# EAGLE schematic ALINHAMENTO_UNIC (EAGLE 6.2)
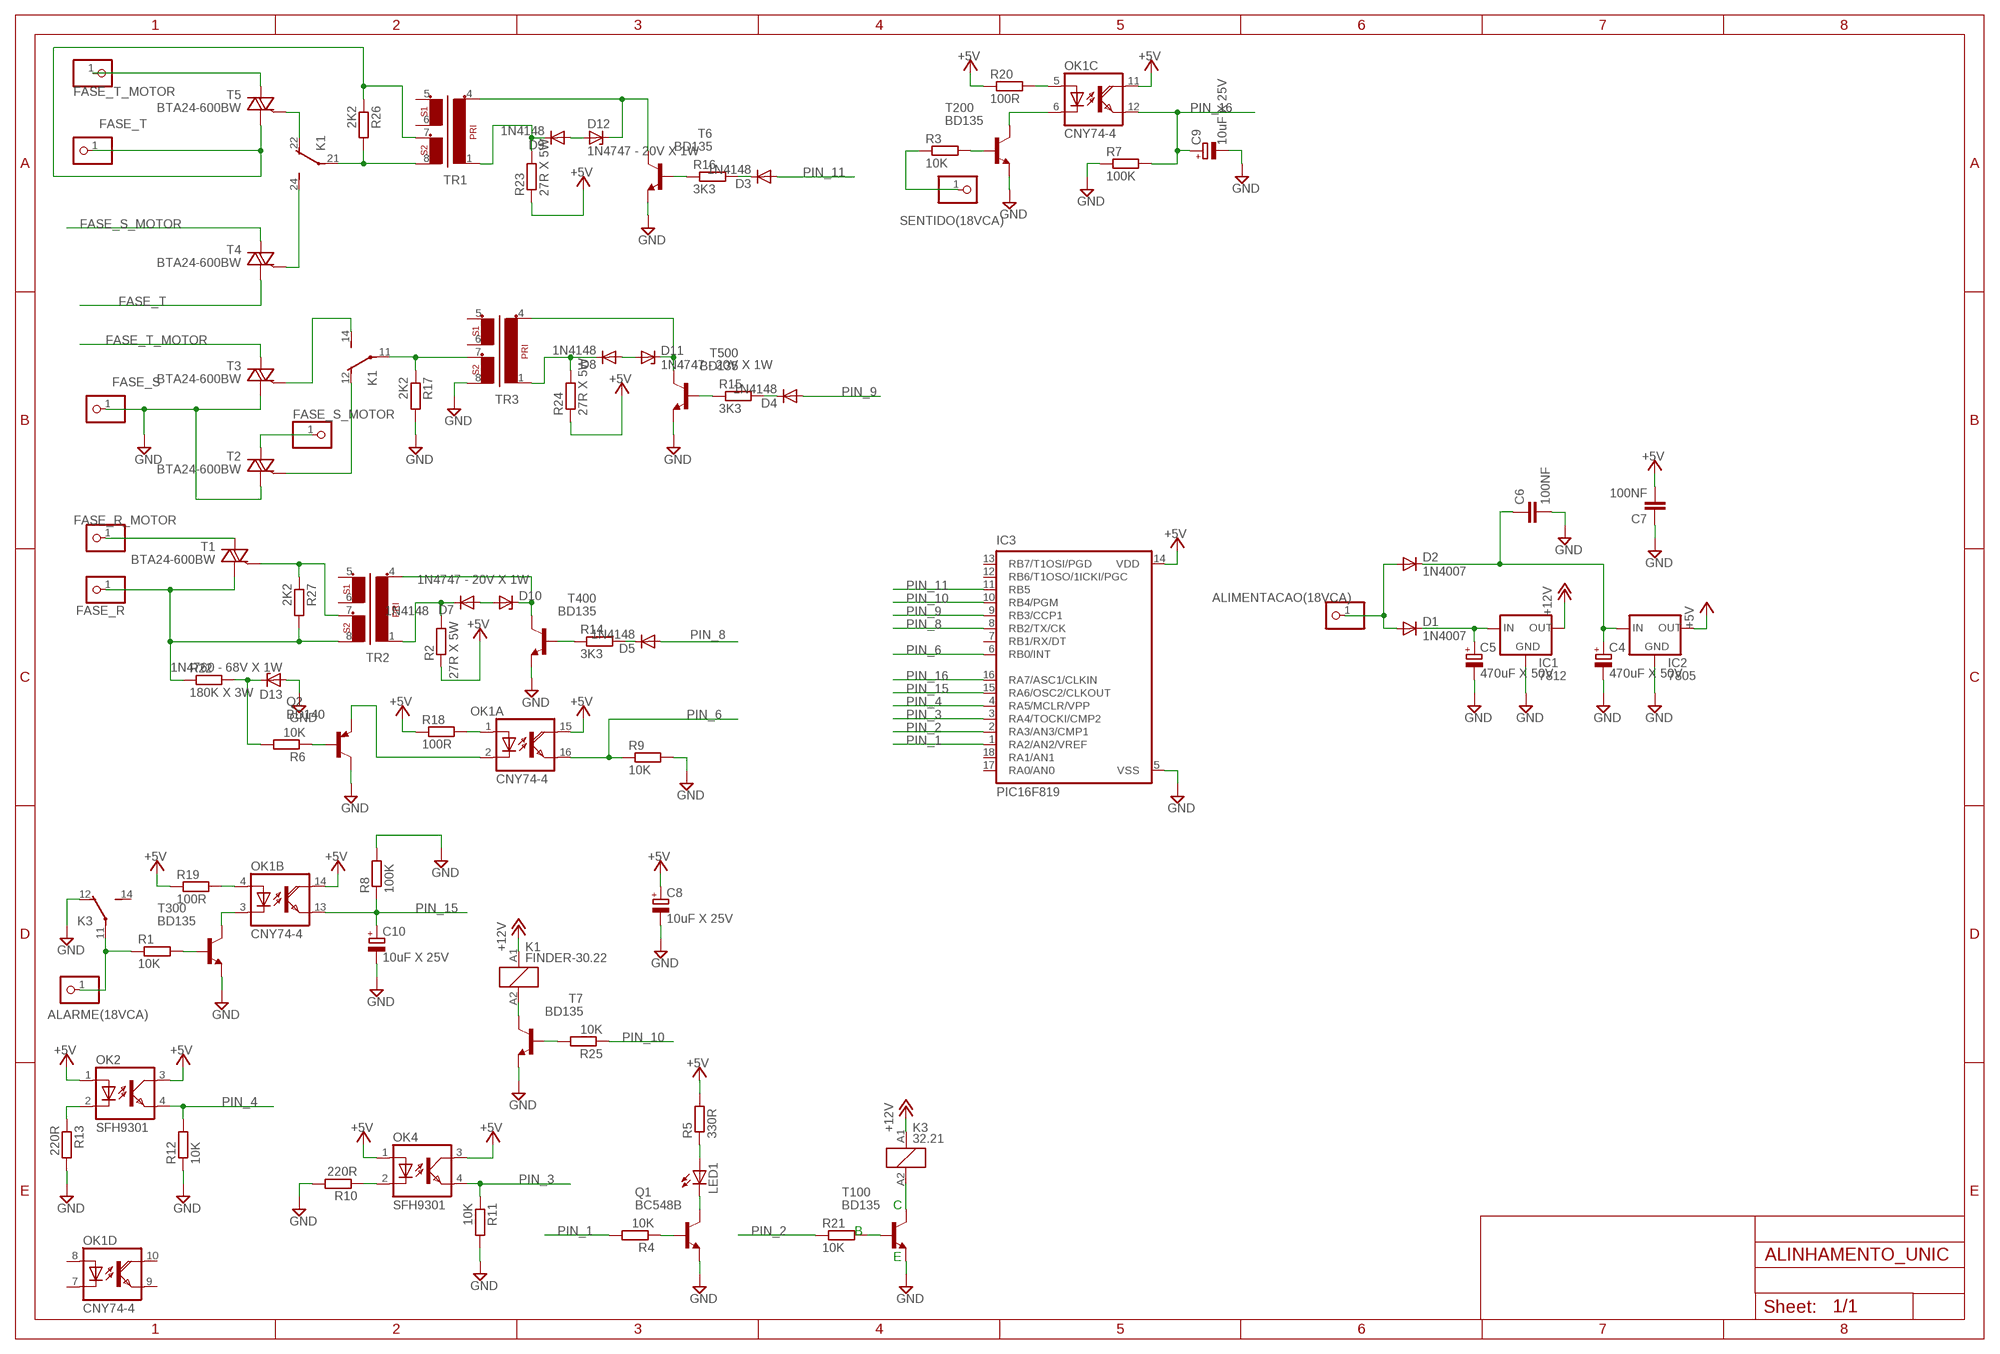
[diagram p0: schematic, sheet 1]

## Parts
ALARME(18VCA)  PINHD-1X1  [1X01]
ALIMENTACAO(18VCA)  PINHD-1X1  [1X01]
C4  470uF X 50V  CPOL-EUE5-13  [E5-13]
C5  470uF X 50V  CPOL-EUE5-13  [E5-13]
C6  100NF  C-EU050-025X075  [C050-025X075]
C7  100NF  C-EU050-025X075  [C050-025X075]
C8  10uF X 25V  CPOL-EUE2-5  [E2-5]
C9  10uF X 25V  CPOL-EUE2-5  [E2-5]
C10  10uF X 25V  CPOL-EUE2-5  [E2-5]
D1  1N4007  1N4004  [DO41-10]
D2  1N4007  1N4004  [DO41-10]
D3  1N4148  1N4148DO35-10  [DO35-10]
D4  1N4148  1N4148DO35-10  [DO35-10]
D5  1N4148  1N4148DO35-10  [DO35-10]
D7  1N4148  1N4148DO35-10  [DO35-10]
D8  1N4148  1N4148DO35-10  [DO35-10]
D9  1N4148  1N4148DO35-10  [DO35-10]
D10  1N4747 - 20V X 1W  1N4728  [DO41Z10]
D11  1N4747 - 20V X 1W  1N4728  [DO41Z10]
D12  1N4747 - 20V X 1W  1N4728  [DO41Z10]
D13  1N4760 - 68V X 1W  1N4728  [DO41Z10]
FASE_R  PINHD-1X1  [1X01]
FASE_R_MOTOR  PINHD-1X1  [1X01]
FASE_S  PINHD-1X1  [1X01]
FASE_S_MOTOR  PINHD-1X1  [1X01]
FASE_T  PINHD-1X1  [1X01]
FASE_T_MOTOR  PINHD-1X1  [1X01]
IC1  7812  78MXXS  [78MXXS]
IC2  7805  78MXXS  [78MXXS]
IC3  PIC16F819  PIC16F627P  [DIL18]
K1  FINDER-30.22  [FINDER-30.22]
K3  32.21  [RP51]
LED1  LED5MM  [LED5MM]
OK1  CNY74-4  ILQ30  [DIL16]
OK2  SFH9301  [SFH9301]
OK4  SFH9301  [SFH9301]
Q1  BC548B  [TO92-EBC]
Q2  BD140  [TO126]
R1  10K  R-EU_0207/10  [0207/10]
R2  27R X 5W  R-EU_0617/22  [0617/22]
R3  10K  R-EU_0207/10  [0207/10]
R4  10K  R-EU_0207/10  [0207/10]
R5  330R  R-EU_0207/10  [0207/10]
R6  10K  R-EU_0207/10  [0207/10]
R7  100K  R-EU_0207/10  [0207/10]
R8  100K  R-EU_0207/10  [0207/10]
R9  10K  R-EU_0207/10  [0207/10]
R10  220R  R-EU_0207/10  [0207/10]
R11  10K  R-EU_0207/10  [0207/10]
R12  10K  R-EU_0207/10  [0207/10]
R13  220R  R-EU_0207/10  [0207/10]
R14  3K3  R-EU_0207/10  [0207/10]
R15  3K3  R-EU_0207/10  [0207/10]
R16  3K3  R-EU_0207/10  [0207/10]
R17  2K2  R-EU_0207/10  [0207/10]
R18  100R  R-EU_0207/10  [0207/10]
R19  100R  R-EU_0207/10  [0207/10]
R20  100R  R-EU_0207/10  [0207/10]
R21  10K  R-EU_0207/10  [0207/10]
R22  180K X 3W  R-EU_0617/22  [0617/22]
R23  27R X 5W  R-EU_0617/22  [0617/22]
R24  27R X 5W  R-EU_0617/22  [0617/22]
R25  10K  R-EU_0207/10  [0207/10]
R26  2K2  R-EU_0207/10  [0207/10]
R27  2K2  R-EU_0207/10  [0207/10]
SENTIDO(18VCA)  PINHD-1X1  [1X01]
T1  BTA24-600BW  BTA26-V  [TOP3S-1]
T2  BTA24-600BW  BTA26-V  [TOP3S-1]
T3  BTA24-600BW  BTA26-V  [TOP3S-1]
T4  BTA24-600BW  BTA26-V  [TOP3S-1]
T5  BTA24-600BW  BTA26-V  [TOP3S-1]
T6  BD135  BD139  [TO126]
T7  BD135  BD139  [TO126]
T100  BD135  BD139  [TO126]
T200  BD135  BD139  [TO126]
T300  BD135  BD139  [TO126]
T400  BD135  BD139  [TO126]
T500  BD135  BD139  [TO126]
TR1  EE20-2  [EE20-2]
TR2  EE20-2  [EE20-2]
TR3  EE20-2  [EE20-2]

## Nets
+5V: C7.2 C8.+ IC2.OUT IC3.14(VDD) OK1.11(C:COL) OK1.14(B:COL) OK1.15(A:COL) OK2.1(A) OK2.3(COL) OK4.1(A) OK4.3(COL) R2.1 R5.2 R18.1 R19.1 R20.1 R23.1 R24.1
+12V: IC1.OUT K1.A1 K3.A1
FASE_S_MOTOR: FASE_S_MOTOR.1 T2.A2 T4.A2
FASE_T: FASE_T.1 R26.1 T4.A1 T5.A1 TR1.7
FASE_T_MOTOR: FASE_T_MOTOR.1 T3.A2 T5.A2
GND: C4.- C5.- C6.2 C7.1 C8.- C9.- C10.- D13.A FASE_S.1 IC1.GND IC2.GND IC3.5(VSS) K3.12(O) Q1.E Q2.2(C) R7.1 R8.2 R9.2 R10.2 R11.2 R12.1 R13.2 R17.2 T2.A1 T3.A1 T6.1(E) T7.1(E) T100.1(E) T200.1(E) T300.1(E) T400.1(E) T500.1(E) TR3.8
N$1: OK4.2(C) R10.1
N$2: OK2.2(C) R13.1
N$3: ALIMENTACAO(18VCA).1 D1.A D2.A
N$5: C5.+ D1.C IC1.IN
N$6: R27.1 T1.G TR2.7
N$7: C4.+ C6.1 D2.C IC2.IN
N$9: Q1.B R4.1
N$10: K3.A2 T100.2(C)
N$11: R25.2 T7.3(B)
N$12: LED1.A R5.1
N$13: OK1.1(A:A) R18.2
N$14: K1.A2 T7.2(C)
N$15: D5.C R14.2
N$16: D9.A D12.A
N$17: FASE_R_MOTOR.1 T1.A2
N$18: D4.C R15.2
N$19: D3.C R16.2
N$20: OK1.2(A:C) Q2.1(E)
N$21: Q2.3(B) R6.1
N$22: FASE_R.1 R22.1 R27.2 T1.A1 TR2.8
N$24: D8.A D11.A
N$25: D7.A D10.A
N$26: K1.21(-2:P) R26.2 TR1.8
N$27: K1.22(-2:O) T5.G
N$28: ALARME(18VCA).1 K3.11(P) R1.1
N$29: K1.24(-2:S) T4.G
N$30: K1.11(-1:P) R17.1 TR3.7
N$31: K1.12(-1:O) T2.G
N$32: K1.14(-1:S) T3.G
N$33: R3.1 SENTIDO(18VCA).1
N$34: R3.2 T200.3(B)
N$35: OK1.6(C:C) T200.2(C)
N$36: OK1.5(C:A) R20.2
N$37: D13.C R6.2 R22.2
N$38: R1.2 T300.3(B)
N$39: OK1.3(B:C) T300.2(C)
N$40: OK1.4(B:A) R19.2
N$41: R21.2 T100.3(B)
N$42: LED1.K(C) Q1.C
N$43: R14.1 T400.3(B)
N$44: R15.1 T500.3(B)
N$45: R16.1 T6.3(B)
N$46: D12.C T6.2(C) TR1.4
N$47: D11.C T500.2(C) TR3.4
N$49: D9.C R23.2 TR1.1
N$50: D10.C T400.2(C) TR2.4
N$51: D8.C R24.2 TR3.1
N$52: D7.C R2.2 TR2.1
PIN_1: IC3.1(RA2/AN2/VREF) R4.2
PIN_2: IC3.2(RA3/AN3/CMP1) R21.1
PIN_3: IC3.3(RA4/TOCKI/CMP2) OK4.4(EMIT) R11.1
PIN_4: IC3.4(RA5/MCLR/VPP) OK2.4(EMIT) R12.2
PIN_6: IC3.6(RB0/INT) OK1.16(A:EMI) R9.1
PIN_8: D5.A IC3.8(RB2/TX/CK)
PIN_9: D4.A IC3.9(RB3/CCP1)
PIN_10: IC3.10(RB4/PGM) R25.1
PIN_11: D3.A IC3.11(RB5)
PIN_15: C10.+ IC3.15(RA6/OSC2/CLKOUT) OK1.13(B:EMI) R8.1
PIN_16: C9.+ IC3.16(RA7/ASC1/CLKIN) OK1.12(C:EMI) R7.2
Unconnected: IC3.7(RB1/RX/DT) IC3.12(RB6/T1OSO/1ICKI/PGC) IC3.13(RB7/T1OSI/PGD) IC3.17(RA0/AN0) IC3.18(RA1/AN1) K3.14(S) OK1.7(D:C) OK1.8(D:A) OK1.9(D:EMI) OK1.10(D:COL) TR1.5 TR1.6 TR2.5 TR2.6 TR3.5 TR3.6

## Notes on the sheet
- C
- B
- E

## Library data of the parts
ALARME(18VCA) ALIMENTACAO(18VCA) FASE_R FASE_R_MOTOR FASE_S FASE_S_MOTOR FASE_T FASE_T_MOTOR SENTIDO(18VCA) = pinhead:PINHD-1X1: PIN HEADER
C4 C5 C8-C10 = rcl:CPOL-EU: POLARIZED CAPACITOR, European symbol
C6 C7 = rcl:C-EU: CAPACITOR, European symbol
D1 D2 = diode:1N4004: DIODE general purpose rectifier, 1 A
D3-D5 D7-D9 = diode:1N4148: DIODE high speed (Philips)
D10-D13 = diode:1N4728: Z DIODE 3.3 V, 1W, 5 percent
IC1 IC2 = v-reg:78MXXS: VOLTAGE REGULATOR
IC3 = microchip:PIC16*F62: FLASH-Based 8-Bit CMOS Microcontroller Source: http://ww1.microchip.com/downloads/en/DeviceDoc/40300C.pdf
K1 = relay:FINDER-30.22: SUBMINIATURE DIL-RELAIS FINDER 30.22.9.024.0000 Kontakt max. AC - 125V Distributor: Farnell Bestell Nr.: 1217371 Source: http://www.farnell.com/datasheets/87634.pdf
K3 = relay:32.21
LED1 = led:LED: LED OSRAM: - CHIPLED LG R971, LG N971, LY N971, LG Q971, LY Q971, LO R971, LY R971 LH N974, LH R974 LS Q976, LO Q976, LY Q976 LO Q996 - Hyper CHIPLED LW Q18S LB Q993, LB Q99A, LB R99A - SideLED LS A670, LO A670, LY A670, LG A670, LP A670 LB A673, LV A673, LT A673, LW A673 LH A674 LY A675 LS A676, LA A676, LO A676, LY A676, LW A676 LS A679, LY A679, LG A679 - Hyper Micro SIDELED® LS Y876, LA Y876, LO Y876, LY Y876 LT Y87S - SmartLED LW L88C, LW L88S LB L89C, LB L89S, LG L890 LS L89K, LO L89K, LY L89K LS L896, LA L896, LO L896, LY L896 - TOPLED LS T670, LO T670, LY T670, LG T670, LP T670 LSG T670, LSP T670, LSY T670, LOP T670, LYG T670 LG T671, LOG T671, LSG T671 LB T673, LV T673, LT T673, LW T673 LH T674 LS T676, LA T676, LO T676, LY T676, LB T676, LH T676, LSB T676, LW T676 LB T67C, LV T67C, LT T67C, LS T67K, LO T67K, LY T67K, LW E67C LS E67B, LA E67B, LO E67B, LY E67B, LB E67C, LV E67C, LT E67C LW T67C LS T679, LY T679, LG T679 LS T770, LO T770, LY T770, LG T770, LP T770 LB T773, LV T773, LT T773, LW T773 LH T774 LS E675, LA E675, LY E675, LS T675 LS T776, LA T776, LO T776, LY T776, LB T776 LHGB T686 LT T68C, LB T68C - Hyper Mini TOPLED® LB M676 - Mini TOPLED Santana® LG M470 LS M47K, LO M47K, LY M47K Source: http://www.osram.convergy.de LUXEON: - LUMILED® LXK2-PW12-R00, LXK2-PW12-S00, LXK2-PW14-U00, LXK2-PW14-V00 LXK2-PM12-R00, LXK2-PM12-S00, LXK2-PM14-U00 LXK2-PE12-Q00, LXK2-PE12-R00, LXK2-PE12-S00, LXK2-PE14-T00, LXK2-PE14-U00 LXK2-PB12-K00, LXK2-PB12-L00, LXK2-PB12-M00, LXK2-PB14-N00, LXK2-PB14-P00, LXK2-PB14-Q00 LXK2-PR12-L00, LXK2-PR12-M00, LXK2-PR14-Q00, LXK2-PR14-R00 LXK2-PD12-Q00, LXK2-PD12-R00, LXK2-PD12-S00 LXK2-PH12-R00, LXK2-PH12-S00 LXK2-PL12-P00, LXK2-PL12-Q00, LXK2-PL12-R00 Source: www.luxeon.com KINGBRIGHT: KA-3528ASYC Source: www.kingbright.com
OK1 = optocoupler:ILQ30: SIEMENS OPTO COUPLER
OK2 OK4 = optocoupler:SFH9*: Slotted Interrupter / Gabellichtschranke Source: http://www.osram.convergy.de/
Q1 = transistor-npn:BC548*: NPN Transistor
Q2 = transistor-pnp:BD140: PNP Transistor
R1-R27 = rcl:R-EU_: RESISTOR, European symbol
T1-T5 = triac:BTA26: 25A TRIAC Source: http://www.st.com/stonline/products/literature/ds/7470.pdf
T6 T7 T100 T200 T300 T400 T500 = transistor:BD139: NPN TRANSISTOR
TR1-TR3 = trafo:EE20-2: TRANSFORMER 1 primary winding, 2 secondary windings ERA